# EasyEDA Pro project project.epro

# Board PCB1
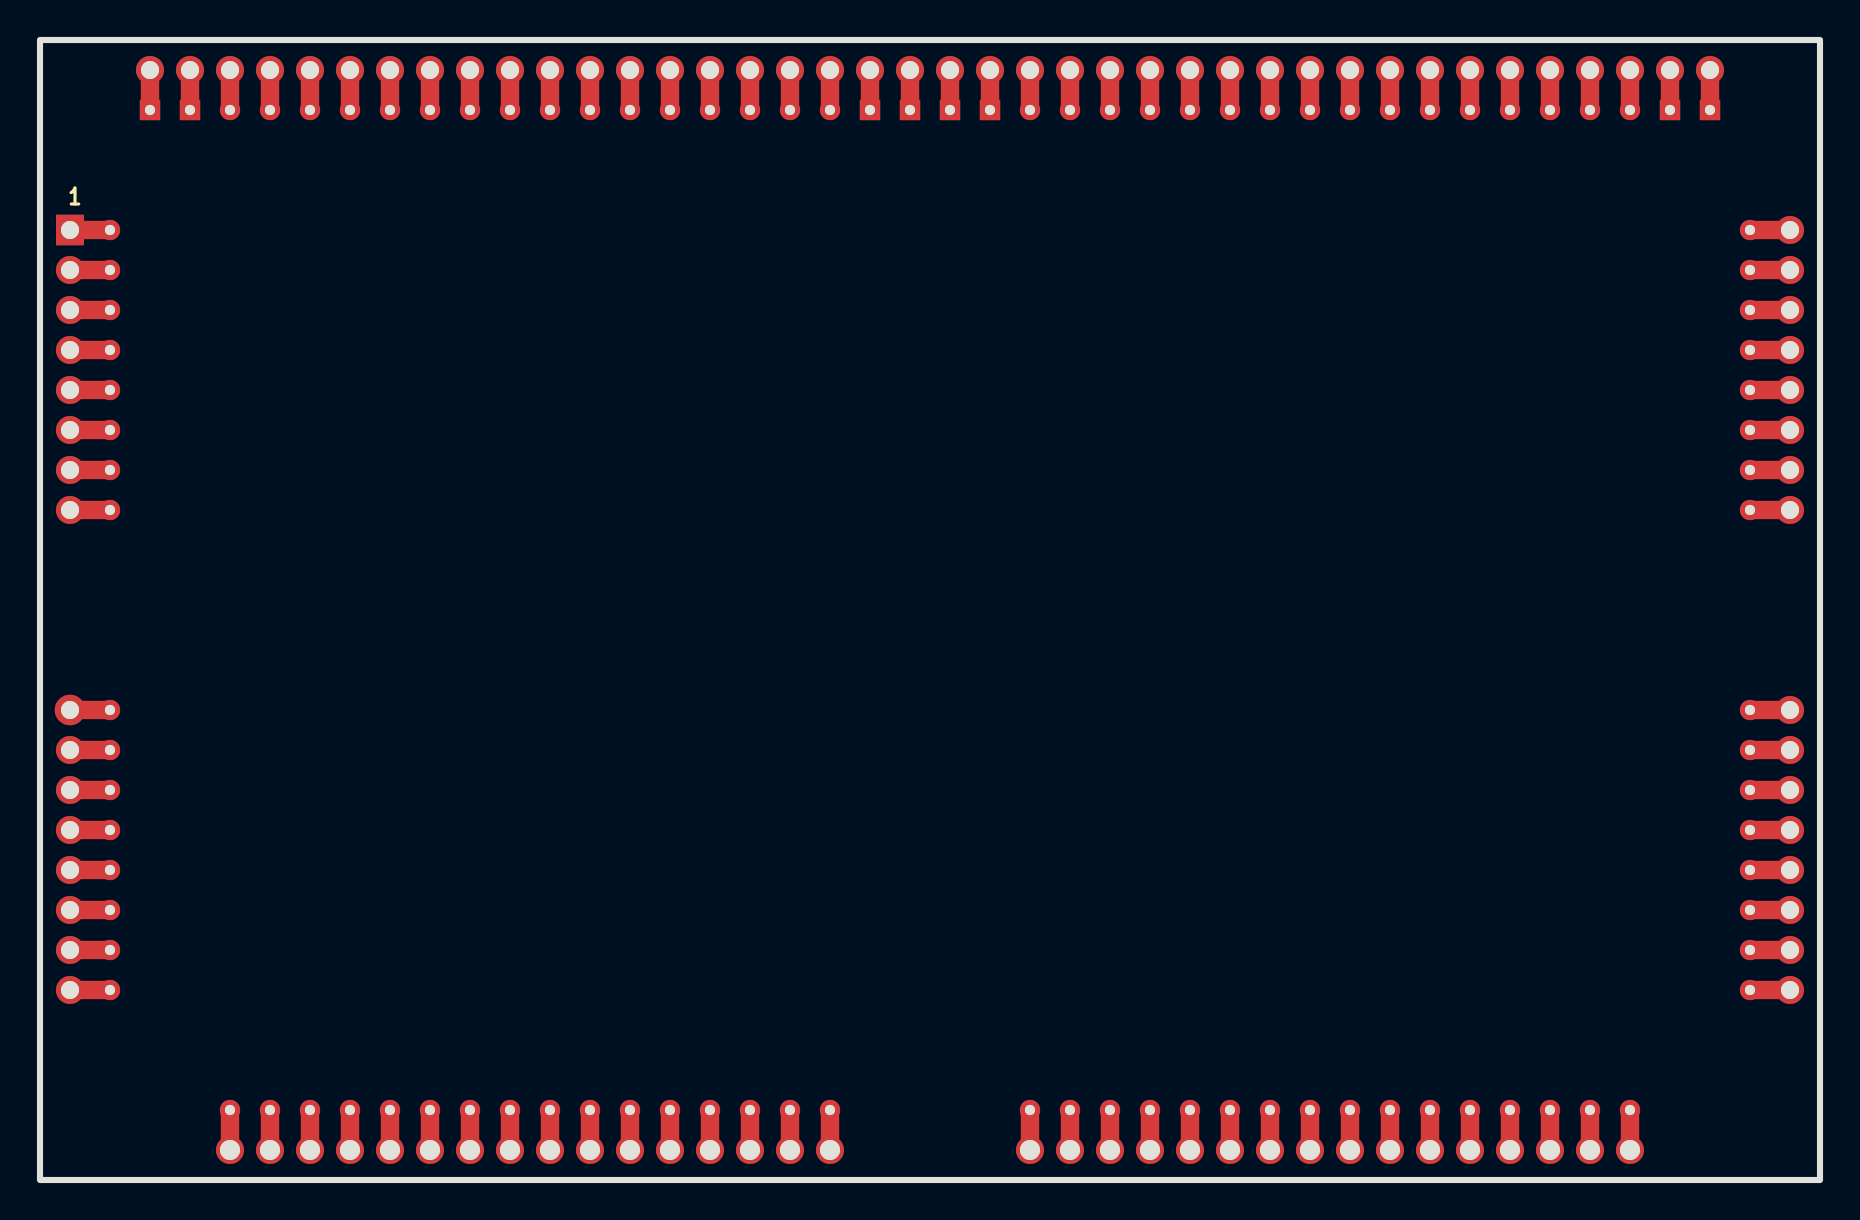
[diagram p0: board, top side]
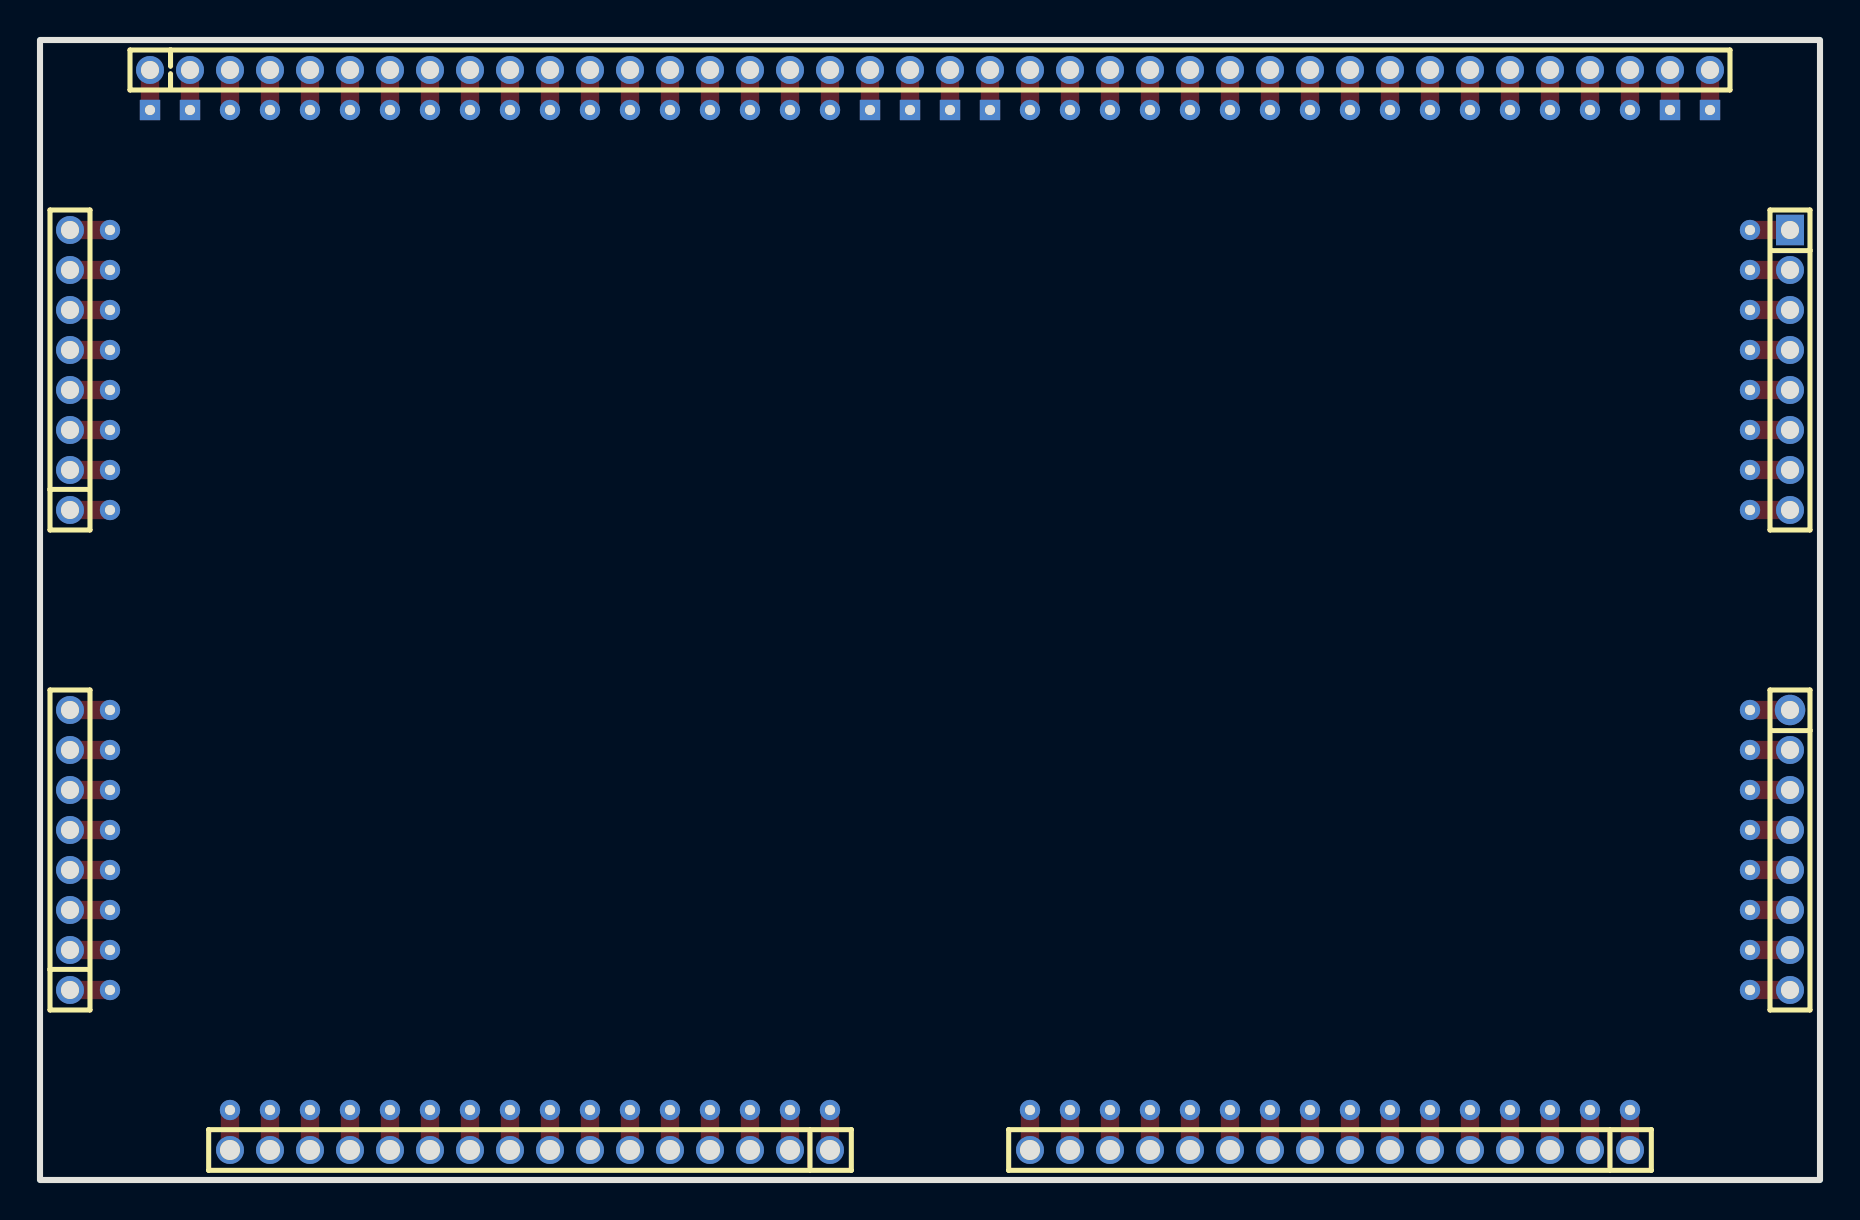
[diagram p1: board, bottom side, seen from below]

Outline 89 x 57 mm; copper layers: Top Layer, Bottom Layer. Coordinates in mm from the lower left corner of the outline.
Outline path: rectangle 0,57 89,0
Stack: Top Layer 0.035mm / Dielectric1 1.51mm FR4 er 4.5 / Bottom Layer 0.035mm

## Design rules (mm)
template: JLCPCB Capability(Two Layers Board)
spacing copperThickness1oz (default): track to track 0.102, other pairs 0.152 to 0.3
spacing copperThickness2oz: track to track 0.203, other pairs 0.152 to 0.3
track width copperThickness1oz (default): min 0.127, default 0.254, max 2.54
track width copperThickness2oz: min 0.203, default 0.254, max 2.54
differential pair differentialPair (default): width min 0.127, default 0.254, max 2.54; gap min 0.152, default 0.152
via viaSize (default): diameter min 0.5, default 0.61, max 10; hole min 0.3, default 0.305, max 6.3

## Placement (name value [footprint] x y rotation side)
H1  PZ200-1-16-Z  [HDR-TH_16P-P2.00-V-M]  24.5 3.5 0 top
H2  PZ200-1-16-Z  [HDR-TH_16P-P2.00-V-M]  64.5 3.5 0 top
H3  PZ200-1-08-Z  [HDR-TH_8P-P2.00-V-M]  3.5 40.5 270 top
H4  PZ200-1-08-Z  [HDR-TH_8P-P2.00-V-M]  3.5 16.5 270 top
H5  PZ200-1-08-Z  [HDR-TH_8P-P2.00-V-M]  85.5 16.5 90 top
H6  PZ200-1-08-Z  [HDR-TH_8P-P2.00-V-M]  85.5 40.5 90 top
H7  PZ200-1-40-Z  [HDR-TH_40P-P2.00-V-M]  44.5 53.5 180 top
H8  PZ200-1-40-Z  [HDR-TH_40P-P2.00-V-M#2]  44.5 55.5 180 bottom
H9  PZ200-1-08-Z  [HDR-TH_8P-P2.00-V-M#2]  1.5 40.5 270 bottom
H10  PZ200-1-08-Z  [HDR-TH_8P-P2.00-V-M#3]  1.5 16.5 270 bottom
H11  PZ200-1-16-Z  [HDR-TH_16P-P2.00-V-M#2]  24.5 1.5 0 bottom
H12  PZ200-1-16-Z  [HDR-TH_16P-P2.00-V-M#2]  64.5 1.5 0 bottom
H13  PZ200-1-08-Z  [HDR-TH_8P-P2.00-V-M#4]  87.5 16.5 90 bottom
H14  PZ200-1-08-Z  [HDR-TH_8P-P2.00-V-M#4]  87.5 40.5 90 bottom

## Footprints (pads in the part's own frame, mm; a bottom-side part is the same pattern mirrored in y, then rotated)
HDR-TH_8P-P2.00-V-M
  round 1.016 hole 0.508: 1(-7,0) 2(-5,0) 3(-3,0) 4(-1,0) 5(1,0) 6(3,0) 7(5,0) 8(7,0)
HDR-TH_8P-P2.00-V-M#2
  rect 1.524x1.4 hole 0.9: 1(-7,0)
  round 1.4 hole 0.9: 2(-5,0) 3(-3,0) 4(-1,0) 5(1,0) 6(3,0) 7(5,0) 8(7,0)
HDR-TH_8P-P2.00-V-M#3
  round 1.524 hole 0.9: 1(-7,0)
  round 1.4 hole 0.9: 2(-5,0) 3(-3,0) 4(-1,0) 5(1,0) 6(3,0) 7(5,0) 8(7,0)
HDR-TH_8P-P2.00-V-M#4
  round 1.4 hole 0.9: 1(-7,0) 2(-5,0) 3(-3,0) 4(-1,0) 5(1,0) 6(3,0) 7(5,0) 8(7,0)
HDR-TH_16P-P2.00-V-M
  round 1.016 hole 0.508: 1(-15,0) 2(-13,0) 3(-11,0) 4(-9,0) 5(-7,0) 6(-5,0) 7(-3,0) 8(-1,0) 9(1,0) 10(3,0) 11(5,0) 12(7,0) 13(9,0) 14(11,0) 15(13,0) 16(15,0)
HDR-TH_16P-P2.00-V-M#2
  round 1.4 hole 1x0.9: 1(-15,0) 2(-13,0) 3(-11,0) 4(-9,0) 5(-7,0) 6(-5,0) 7(-3,0) 8(-1,0) 9(1,0) 10(3,0) 11(5,0) 12(7,0) 13(9,0) 14(11,0) 15(13,0) 16(15,0)
HDR-TH_40P-P2.00-V-M
  rect 1.016x1.016 hole 0.508: 1(-39,0) 2(-37,0) 19(-3,0) 20(-1,0) 21(1,0) 22(3,0) 39(37,0) 40(39,0)
  round 1.016 hole 0.508: 3(-35,0) 4(-33,0) 5(-31,0) 6(-29,0) 7(-27,0) 8(-25,0) 9(-23,0) 10(-21,0) 11(-19,0) 12(-17,0) 13(-15,0) 14(-13,0) 15(-11,0) 16(-9,0) 17(-7,0) 18(-5,0) 23(5,0) 24(7,0) 25(9,0) 26(11,0) 27(13,0) 28(15,0) 29(17,0) 30(19,0) 31(21,0) 32(23,0) 33(25,0) 34(27,0) 35(29,0) 36(31,0) 37(33,0) 38(35,0)
HDR-TH_40P-P2.00-V-M#2
  round 1.4 hole 0.9: 1(-39,0) 2(-37,0) 3(-35,0) 4(-33,0) 5(-31,0) 6(-29,0) 7(-27,0) 8(-25,0) 9(-23,0) 10(-21,0) 11(-19,0) 12(-17,0) 13(-15,0) 14(-13,0) 15(-11,0) 16(-9,0) 17(-7,0) 18(-5,0) 19(-3,0) 20(-1,0) 21(1,0) 22(3,0) 23(5,0) 24(7,0) 25(9,0) 26(11,0) 27(13,0) 28(15,0) 29(17,0) 30(19,0) 31(21,0) 32(23,0) 33(25,0) 34(27,0) 35(29,0) 36(31,0) 37(33,0) 38(35,0) 39(37,0) 40(39,0)

## Nets
$1N1902: H7.1 H8.1
$1N1904: H7.2 H8.2
$1N1906: H7.3 H8.3
$1N1908: H7.4 H8.4
$1N1910: H7.5 H8.5
$1N1912: H7.6 H8.6
$1N1914: H7.7 H8.7
$1N1916: H7.8 H8.8
$1N1918: H7.9 H8.9
$1N1920: H7.10 H8.10
$1N1922: H7.11 H8.11
$1N1924: H7.12 H8.12
$1N1926: H7.13 H8.13
$1N1928: H7.14 H8.14
$1N1930: H7.15 H8.15
$1N1932: H7.16 H8.16
$1N1934: H7.17 H8.17
$1N1936: H7.18 H8.18
$1N1938: H7.19 H8.19
$1N1940: H7.20 H8.20
$1N1942: H7.21 H8.21
$1N1944: H7.22 H8.22
$1N1946: H7.23 H8.23
$1N1948: H7.24 H8.24
$1N1950: H7.25 H8.25
$1N1952: H7.26 H8.26
$1N1954: H7.27 H8.27
$1N1956: H7.28 H8.28
$1N1958: H7.29 H8.29
$1N1960: H7.30 H8.30
$1N1962: H7.31 H8.31
$1N1964: H7.32 H8.32
$1N1966: H7.33 H8.33
$1N1968: H7.34 H8.34
$1N1970: H7.35 H8.35
$1N1972: H7.36 H8.36
$1N1974: H7.37 H8.37
$1N1976: H7.38 H8.38
$1N1978: H7.39 H8.39
$1N1980: H7.40 H8.40
$1N2045: H3.1 H9.1
$1N2047: H3.2 H9.2
$1N2049: H3.3 H9.3
$1N2051: H3.4 H9.4
$1N2053: H3.5 H9.5
$1N2055: H3.6 H9.6
$1N2057: H3.7 H9.7
$1N2059: H3.8 H9.8
$1N2124: H4.1 H10.1
$1N2126: H4.2 H10.2
$1N2128: H4.3 H10.3
$1N2130: H4.4 H10.4
$1N2132: H4.5 H10.5
$1N2134: H4.6 H10.6
$1N2136: H4.7 H10.7
$1N2138: H4.8 H10.8
$1N2227: H1.1 H11.1
$1N2229: H1.2 H11.2
$1N2231: H1.3 H11.3
$1N2233: H1.4 H11.4
$1N2235: H1.5 H11.5
$1N2237: H1.6 H11.6
$1N2239: H1.7 H11.7
$1N2241: H1.8 H11.8
$1N2243: H1.9 H11.9
$1N2245: H1.10 H11.10
$1N2247: H1.11 H11.11
$1N2249: H1.12 H11.12
$1N2251: H1.13 H11.13
$1N2253: H1.14 H11.14
$1N2255: H1.15 H11.15
$1N2257: H1.16 H11.16
$1N2346: H2.1 H12.1
$1N2348: H2.2 H12.2
$1N2350: H2.3 H12.3
$1N2352: H2.4 H12.4
$1N2354: H2.5 H12.5
$1N2356: H2.6 H12.6
$1N2358: H2.7 H12.7
$1N2360: H2.8 H12.8
$1N2362: H2.9 H12.9
$1N2364: H2.10 H12.10
$1N2366: H2.11 H12.11
$1N2368: H2.12 H12.12
$1N2370: H2.13 H12.13
$1N2372: H2.14 H12.14
$1N2374: H2.15 H12.15
$1N2376: H2.16 H12.16
$1N2441: H5.1 H13.1
$1N2443: H5.2 H13.2
$1N2445: H5.3 H13.3
$1N2447: H5.4 H13.4
$1N2449: H5.5 H13.5
$1N2451: H5.6 H13.6
$1N2453: H5.7 H13.7
$1N2455: H5.8 H13.8
$1N2520: H6.1 H14.1
$1N2522: H6.2 H14.2
$1N2524: H6.3 H14.3
$1N2526: H6.4 H14.4
$1N2528: H6.5 H14.5
$1N2530: H6.6 H14.6
$1N2532: H6.7 H14.7
$1N2534: H6.8 H14.8

## Routing (per net, layer and track width the routed paths; a pad name or vN(x,y) marks a point on that pad's centre or on a via; arc(x,y) is an arc through that point)
$1N1902: length 2
  Top Layer w0.914: H7.1 H8.1
$1N1904: length 2
  Top Layer w0.914: H7.2 H8.2
$1N1906: length 2
  Top Layer w0.914: H7.3 H8.3
$1N1908: length 2
  Top Layer w0.914: H7.4 H8.4
$1N1910: length 2
  Top Layer w0.914: H7.5 H8.5
$1N1912: length 2
  Top Layer w0.914: H7.6 H8.6
$1N1914: length 2
  Top Layer w0.914: H7.7 H8.7
$1N1916: length 2
  Top Layer w0.914: H7.8 H8.8
$1N1918: length 2
  Top Layer w0.914: H7.9 H8.9
$1N1920: length 2
  Top Layer w0.914: H7.10 H8.10
$1N1922: length 2
  Top Layer w0.914: H7.11 H8.11
$1N1924: length 2
  Top Layer w0.914: H7.12 H8.12
$1N1926: length 2
  Top Layer w0.914: H7.13 H8.13
$1N1928: length 2
  Top Layer w0.914: H7.14 H8.14
$1N1930: length 2
  Top Layer w0.914: H7.15 H8.15
$1N1932: length 2
  Top Layer w0.914: H7.16 H8.16
$1N1934: length 2
  Top Layer w0.914: H7.17 H8.17
$1N1936: length 2
  Top Layer w0.914: H7.18 H8.18
$1N1938: length 2
  Top Layer w0.914: H7.19 H8.19
$1N1940: length 2
  Top Layer w0.914: H7.20 H8.20
$1N1942: length 2
  Top Layer w0.914: H7.21 H8.21
$1N1944: length 2
  Top Layer w0.914: H7.22 H8.22
$1N1946: length 2
  Top Layer w0.914: H7.23 H8.23
$1N1948: length 2
  Top Layer w0.914: H7.24 H8.24
$1N1950: length 2
  Top Layer w0.914: H7.25 H8.25
$1N1952: length 2
  Top Layer w0.914: H8.26 H7.26
$1N1954: length 2
  Top Layer w0.914: H8.27 H7.27
$1N1956: length 2
  Top Layer w0.914: H8.28 H7.28
$1N1958: length 2
  Top Layer w0.914: H8.29 H7.29
$1N1960: length 2
  Top Layer w0.914: H8.30 H7.30
$1N1962: length 2
  Top Layer w0.914: H8.31 H7.31
$1N1964: length 2
  Top Layer w0.914: H7.32 H8.32
$1N1966: length 2
  Top Layer w0.914: H8.33 H7.33
$1N1968: length 2
  Top Layer w0.914: H8.34 H7.34
$1N1970: length 2
  Top Layer w0.914: H8.35 H7.35
$1N1972: length 2
  Top Layer w0.914: H8.36 H7.36
$1N1974: length 2
  Top Layer w0.914: H8.37 H7.37
$1N1976: length 2
  Top Layer w0.914: H8.38 H7.38
$1N1978: length 2
  Top Layer w0.914: H7.39 H8.39
$1N1980: length 2
  Top Layer w0.914: H7.40 H8.40
$1N2045: length 2
  Top Layer w0.914: H9.1 H3.1
$1N2047: length 2
  Top Layer w0.914: H9.2 H3.2
$1N2049: length 2
  Top Layer w0.914: H9.3 H3.3
$1N2051: length 2
  Top Layer w0.914: H3.4 H9.4
$1N2053: length 2
  Top Layer w0.914: H9.5 H3.5
$1N2055: length 2
  Top Layer w0.914: H3.6 H9.6
$1N2057: length 2
  Top Layer w0.914: H3.7 H9.7
$1N2059: length 2
  Top Layer w0.914: H9.8 H3.8
$1N2124: length 2
  Top Layer w0.914: H10.1 H4.1
$1N2126: length 2
  Top Layer w0.914: H10.2 H4.2
$1N2128: length 2
  Top Layer w0.914: H10.3 H4.3
$1N2130: length 2
  Top Layer w0.914: H10.4 H4.4
$1N2132: length 2
  Top Layer w0.914: H4.5 H10.5
$1N2134: length 2
  Top Layer w0.914: H10.6 H4.6
$1N2136: length 2
  Top Layer w0.914: H10.7 H4.7
$1N2138: length 2
  Top Layer w0.914: H4.8 H10.8
$1N2227: length 2
  Top Layer w0.914: H11.1 H1.1
$1N2229: length 2
  Top Layer w0.914: H11.2 H1.2
$1N2231: length 2
  Top Layer w0.914: H11.3 H1.3
$1N2233: length 2
  Top Layer w0.914: H11.4 H1.4
$1N2235: length 2
  Top Layer w0.914: H11.5 H1.5
$1N2237: length 2
  Top Layer w0.914: H11.6 H1.6
$1N2239: length 2
  Top Layer w0.914: H11.7 H1.7
$1N2241: length 2
  Top Layer w0.914: H11.8 H1.8
$1N2243: length 2
  Top Layer w0.914: H11.9 H1.9
$1N2245: length 2
  Top Layer w0.914: H11.10 H1.10
$1N2247: length 2
  Top Layer w0.914: H11.11 H1.11
$1N2249: length 2
  Top Layer w0.914: H11.12 H1.12
$1N2251: length 2
  Top Layer w0.914: H11.13 H1.13
$1N2253: length 2
  Top Layer w0.914: H11.14 H1.14
$1N2255: length 2
  Top Layer w0.914: H11.15 H1.15
$1N2257: length 2
  Top Layer w0.914: H11.16 H1.16
$1N2346: length 2
  Top Layer w0.914: H12.1 H2.1
$1N2348: length 2
  Top Layer w0.914: H12.2 H2.2
$1N2350: length 2
  Top Layer w0.914: H2.3 H12.3
$1N2352: length 2
  Top Layer w0.914: H2.4 H12.4
$1N2354: length 2
  Top Layer w0.914: H2.5 H12.5
$1N2356: length 2
  Top Layer w0.914: H2.6 H12.6
$1N2358: length 2
  Top Layer w0.914: H12.7 H2.7
$1N2360: length 2
  Top Layer w0.914: H2.8 H12.8
$1N2362: length 2
  Top Layer w0.914: H12.9 H2.9
$1N2364: length 2
  Top Layer w0.914: H12.10 H2.10
$1N2366: length 2
  Top Layer w0.914: H12.11 H2.11
$1N2368: length 2
  Top Layer w0.914: H2.12 H12.12
$1N2370: length 2
  Top Layer w0.914: H2.13 H12.13
$1N2372: length 2
  Top Layer w0.914: H2.14 H12.14
$1N2374: length 2
  Top Layer w0.914: H2.15 H12.15
$1N2376: length 2
  Top Layer w0.914: H2.16 H12.16
$1N2441: length 2
  Top Layer w0.914: H13.1 H5.1
$1N2443: length 2
  Top Layer w0.914: H13.2 H5.2
$1N2445: length 2
  Top Layer w0.914: H5.3 H13.3
$1N2447: length 2
  Top Layer w0.914: H13.4 H5.4
$1N2449: length 2
  Top Layer w0.914: H5.5 H13.5
$1N2451: length 2
  Top Layer w0.914: H13.6 H5.6
$1N2453: length 2
  Top Layer w0.914: H5.7 H13.7
$1N2455: length 2
  Top Layer w0.914: H5.8 H13.8
$1N2520: length 2
  Top Layer w0.914: H6.1 H14.1
$1N2522: length 2
  Top Layer w0.914: H14.2 H6.2
$1N2524: length 2
  Top Layer w0.914: H6.3 H14.3
$1N2526: length 2
  Top Layer w0.914: H14.4 H6.4
$1N2528: length 2
  Top Layer w0.914: H6.5 H14.5
$1N2530: length 2
  Top Layer w0.914: H6.6 H14.6
$1N2532: length 2
  Top Layer w0.914: H14.7 H6.7
$1N2534: length 2
  Top Layer w0.914: H6.8 H14.8

## Text on the board
Top Silkscreen Layer: 1
